# EasyEDA schematic SCH_ESP-CellCore_USB_Interlock_RevA2_IMPORT.json
TITLE: Sheet_1; REV: 1.0; Date: 2026-08-07; Sheet: 1/1; Drawn By: evilroot; Company: Your Company
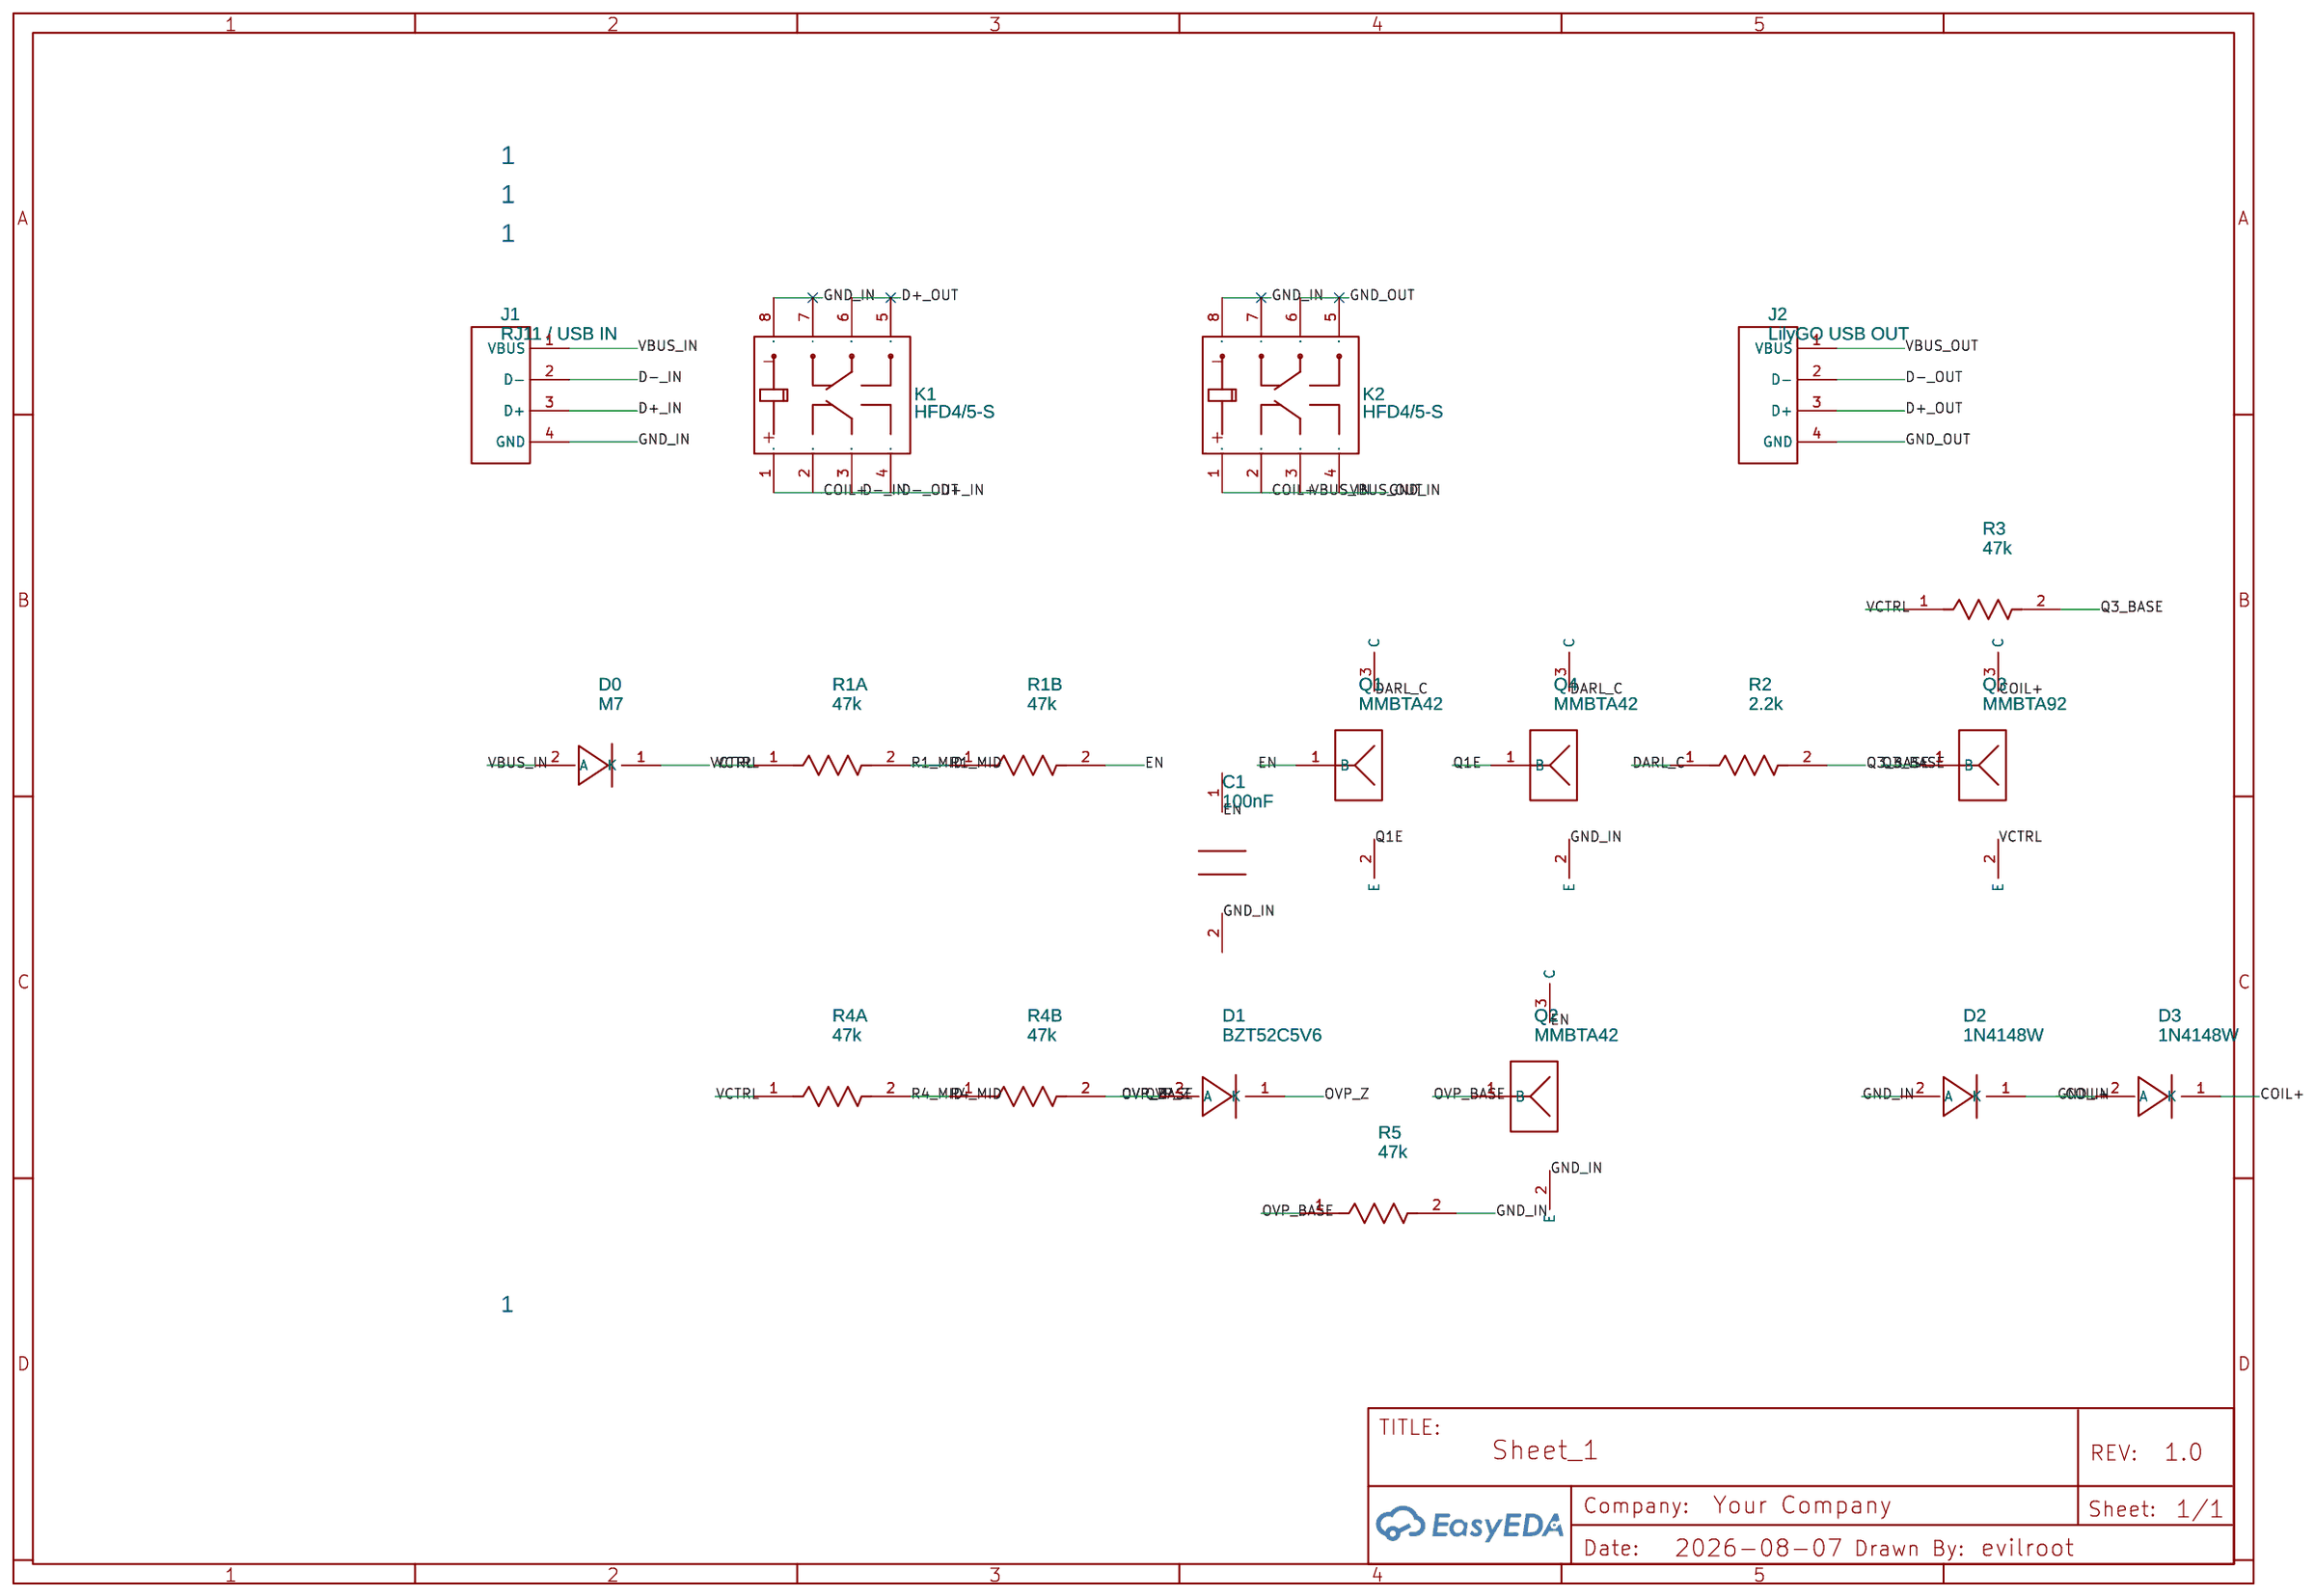
[diagram p0: schematic sheet]

## Parts
C1  100nF  [C0805]
D0  M7  [SMA]
D1  BZT52C5V6  [SOD-123]
D2  1N4148W  [SOD-123]
D3  1N4148W  [SOD-123]
J1  RJ11 / USB IN  [HDR-TH_1x4_P2.54]
J2  LilyGO USB OUT  [HDR-TH_1x4_P2.54]
K1  HFD4/5-S  [RELAY-SMD_HFD4-5-SR]
K2  HFD4/5-S  [RELAY-SMD_HFD4-5-SR]
Q1  MMBTA42  [SOT-23]
Q2  MMBTA42  [SOT-23]
Q3  MMBTA92  [SOT-23]
Q4  MMBTA42  [SOT-23]
R1A  47k  [R0805]
R1B  47k  [R0805]
R2  2.2k  [R0805]
R3  47k  [R0805]
R4A  47k  [R0805]
R4B  47k  [R0805]
R5  47k  [R0805]

## Library data of the parts
C1 = -: Supplier: LCSC; Supplier Part: C75414
D0 = -: Supplier: LCSC; Supplier Part: C115218
D1 = -: Supplier: LCSC; Supplier Part: C216713
D2 D3 = -: Supplier: LCSC; Supplier Part: C81598
J1 J2 = -: Supplier: LCSC
K1 K2 = HFD4/5-S: Supplier: LCSC; Manufacturer: HF(宏发); Manufacturer Part: HFD4/5-SR; Supplier Part: C64399; JLCPCB Part Class: Extended Part
Q1 Q2 Q4 = -: Supplier: LCSC; Supplier Part: C2858524
Q3 = -: Supplier: LCSC; Supplier Part: C909761
R1A R1B R3 R4A R4B R5 = -: Supplier: LCSC; Supplier Part: C144558
R2 = -: Supplier: LCSC; Supplier Part: C17520

## Nets
GND_OUT: J2.4(GND) K2.6
COIL+: C1.2 D0.2(A) D2.1(K) D2.2(A) D3.1(K) D3.2(A) J1.1(VBUS) J1.2(D-) J1.3(D+) J1.4(GND) J2.1(VBUS) J2.2(D-) K1.1 K1.2 K1.3 K1.4 K1.8 K2.1 K2.2 K2.3 K2.4 K2.8 Q2.2(E) Q3.3(C) Q4.2(E) R5.2
D+_OUT: J2.3(D+) K1.6
DARL_C: Q1.3(C) Q4.3(C) R2.1
EN: C1.1 Q1.1(B) Q2.3(C) R1B.2
OVP_BASE: D1.1(K) D1.2(A) Q2.1(B) R4B.2 R5.1
Q1E: Q1.2(E) Q4.1(B)
Q3_BASE: Q3.1(B) R2.2 R3.2
R1_MID: R1A.2 R1B.1
R4_MID: R4A.2 R4B.1
VCTRL: D0.1(K) Q3.2(E) R1A.1 R3.1 R4A.1

Not connected (* = marked no-connect by the designer): K1 5* 7*; K2 5* 7*

## Notes on the sheet
- 1
- 1
- 1
- 1
